# EAGLE design XForm_Clang (EAGLE 9.6.0)
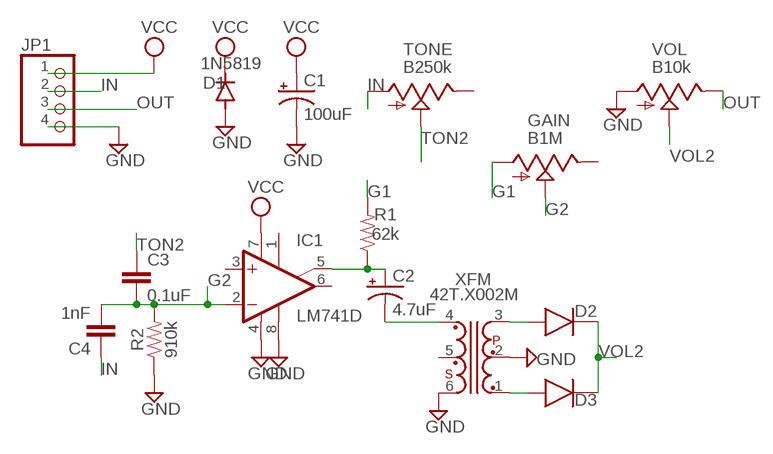
[diagram p0: schematic, sheet 1]

## Parts
C1  100uF  CAP_SMD+THRUPAN_B  [PAN_B_SMD+THRU]
C2  4.7uF  CAP_SMD+THRUPAN_B  [PAN_B_SMD+THRU]
C3  0.1uF  0.1UF-0603-25V-(+80/-20%)  [0603]
C4  1nF  1.0NF/1000PF-0603-50V-10%  [0603]
D1  1N5819  DIODE-SOD123  [SOD123]
D2  1N4148  [D35-10]
D3  1N4148  [D35-10]
GAIN  B1M  9MM_SNAP-IN_POT_  [9MM_SNAP-IN_POT]
IC1  LM741D  [SO08]
JP1  PINHD-1X4  [1X04]
R1  62k  62KOHM-0603-1/10W-5%  [0603]
R2  910k  820KOHM-0603-1/10W-1%  [0603]
TONE  B250k  9MM_SNAP-IN_POT_  [9MM_SNAP-IN_POT]
VOL  B10k  9MM_SNAP-IN_POT_  [9MM_SNAP-IN_POT]
XFM  42T.X002M  [42TM]

## Nets
G1: GAIN.1(A) R1.2
G2: C3.2 C4.2 GAIN.2(S) IC1.2(-IN) R2.2
GND: C1.- C1.--(-) D1.A IC1.4(V-) IC1.8(OPT) JP1.4 R2.1 VOL.1(A) XFM.2 XFM.6
IN: C4.1 JP1.2 TONE.1(A)
N$1: D2.A XFM.3
N$2: C2.+ C2.++(+) IC1.5(ON2) R1.1
N$3: C2.- C2.--(-) XFM.4
N$4: D3.A XFM.1
OUT: JP1.3 VOL.3(E)
TON2: C3.1 TONE.2(S)
VCC: C1.+ C1.++(+) D1.C IC1.7(V+) JP1.1
VOL2: D2.K D3.K VOL.2(S)
Unconnected: GAIN.3(E) IC1.1(ON1) IC1.3(+IN) IC1.6(OUT) TONE.3(E) XFM.5

## Library data of the parts
C1 C2 = MusicThingModular:CAP_SMD+THRU
C3 = SparkFun-Capacitors:0.1UF: 0.1µF ceramic capacitors A capacitor is a passive two-terminal electrical component used to store electrical energy temporarily in an electric field.; PROD_ID: CAP-00810
C4 = SparkFun-Capacitors:1.0NF/1000PF: 1nF/1,000pF ceramic capacitors A capacitor is a passive two-terminal electrical component used to store electrical energy temporarily in an electric field.; PROD_ID: CAP-07886
D1 = diode:DIODE-: DIODE
D2 D3 = ldr:1N4148
GAIN TONE VOL = MusicThingModular:9MM_SNAP-IN_POT: 9mm vertical snap-in pot, Alpha / Panasonic style
IC1 = linear:*741: OP AMP
JP1 = Connector:PINHD-1X4: PIN HEADER; CATEGORY: CONNECTOR; SUB-CATEGORY: PIN-HEADER
R1 = SparkFun-Resistors:62KOHM: 62kΩ resistor A resistor is a passive two-terminal electrical component that implements electrical resistance as a circuit element. Resistors act to reduce current flow, and, at the same time, act to lower voltage levels within circuits. - Wikipedia
R2 = SparkFun-Resistors:820KOHM: 820kΩ resistor A resistor is a passive two-terminal electrical component that implements electrical resistance as a circuit element. Resistors act to reduce current flow, and, at the same time, act to lower voltage levels within circuits. - Wikipedia; PROD_ID: RES-13247; VALUE: 820k
XFM = transformer:42T.X: Xicon Micro-Mini EI-12 Audio Transformers 42TL/42TC/42TM Series Source: http://www.mouser.com//catalog/specsheets/164201.pdf http://www.mouser.com/catalog/specsheets/114225.pdf http://www.mouser.com/catalog/specsheets/164267.pdf

## Board
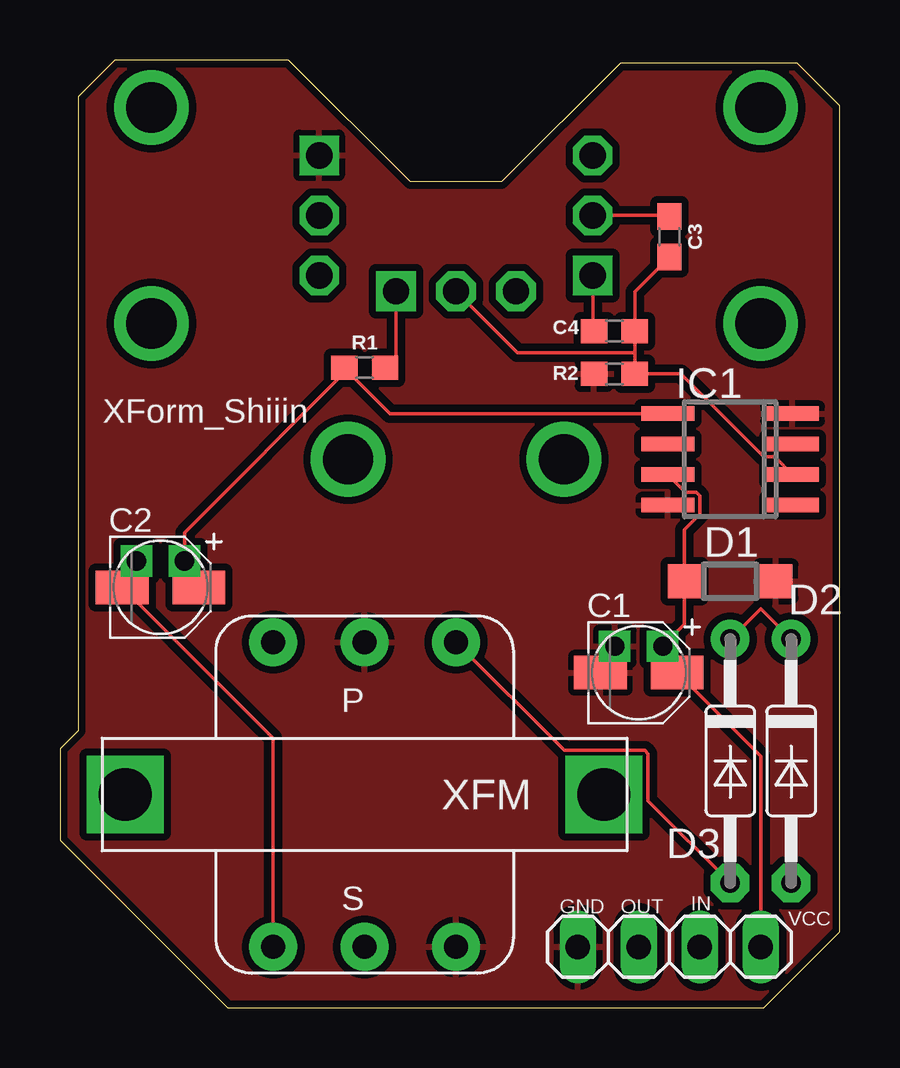
[diagram p1: board, top side]
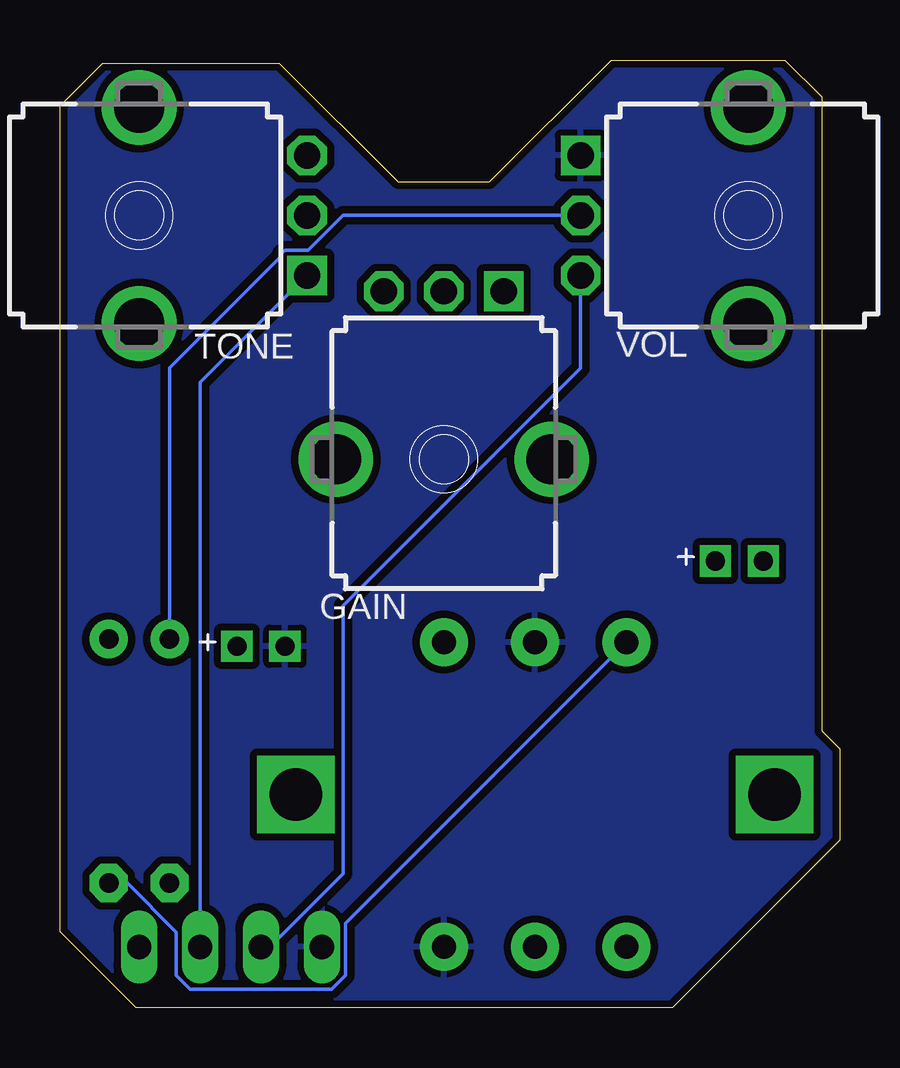
[diagram p2: board, bottom side, seen from below]

Size 32.51 x 39.5 mm. Coordinates in mm from the lower left corner, seen from the top.
Outline: 6.99,0 29.34,0 32.51,3.17 32.51,37.59 30.73,39.37 23.37,39.37 18.41,34.42 14.61,34.42 9.53,39.5 2.29,39.5 0.76,37.97 0.76,11.56 0,10.79 0,6.99 6.99,0
Copper layers (1*16): Top 0.035mm / dielectric 1.5mm / Bottom 0.035mm
Design rules "default *": minimum track width 6mil, minimum drill 0.35mm, track to track 6mil, track to pad 6mil, pad to pad 6mil, via to via 6mil, smd to smd 6mil, copper to edge 6mil, drill to drill 6mil, minimum pad ring 10mil, minimum via ring 8mil, stop-mask expansion 4mil, vias tented up to drill 0mil, thermal gap 10mil

### Footprints (pad centres in the part's own frame; a part is rotated, then mirrored left to right if it is on the bottom)
PAN_B_SMD+THRU = smd 2.2 x 1.4: + 1.6,0; - -1.6,0 | drill 0.8 pad 0.9 square: ++ 1,1.1; -- -1,1.1
0603 = smd 1.1 x 1: 1 -0.85,0; 2 0.85,0
SOD123 = smd 1.4 x 1.4: A 1.9,0; C -1.9,0
D35-10 = drill 0.813 pad 1.6 octagon: A 5.08,0 | drill 0.813 pad 1.6: K -5.08,0
9MM_SNAP-IN_POT = drill 1.1 square: 1 -2.5,-7 | drill 1.1 octagon: 2 0,-7; 3 2.5,-7 | drill 2.1 pad 2.794: CHASSIS1 -4.5,0; CHASSIS2 4.5,0
SO08 = smd 0.6 x 2.2: 1 -1.905,-2.6; 2 -0.635,-2.6; 3 0.635,-2.6; 4 1.905,-2.6; 5 1.905,2.6; 6 0.635,2.6; 7 -0.635,2.6; 8 -1.905,2.6
1X04 = drill 1.016 long: 1 -3.81,0; 2 -1.27,0; 3 1.27,0; 4 3.81,0
42TM = drill 1 pad 2: 1 -3.81,-6.35; 2 0,-6.35; 3 3.81,-6.35; 4 3.81,6.35; 5 0,6.35; 6 -3.81,6.35 | drill 2.2 square: P$1 -9.982,0; P$2 9.982,0

### Placement (x,y rotation side)
C1  24.13,13.97 0 top
C2  4.19,17.53 0 top
C3  25.4,32.13 270 top
C4  23.11,28.19 0 top
D1  27.94,17.78 0 top
D2  30.48,10.29 270 top
D3  27.94,10.29 270 top
GAIN  16.51,22.86 180 bottom
IC1  27.94,22.86 90 top
JP1  25.4,2.54 180 top
R1  12.7,26.67 0 top
R2  23.11,26.42 0 top
TONE  29.21,33.02 90 bottom
VOL  3.81,33.02 270 bottom
XFM  12.7,8.89 180 top

### Tracks (layer width: path | path; a pad name or v marks a point on that pad's centre or on a via)
G1
  Top 0.152: GAIN.1 14.01,27.13 R1.2
G2
  Top 0.152: 23.96,27.3 R2.2 25.9,26.42 29.34,22.97 29.8,22.97 IC1.2 | 23.96,27.3 C4.2 23.96,29.84 C3.2 | GAIN.2 19.07,27.3 23.96,27.3
GND
  pour Bottom (isolate 0.305): -0.38,40.01 -0.38,-0.13 0,-0.51 32.89,-0.51 33.02,-0.38 33.02,40.01
  pour Top (isolate 0.305): -0.38,40.01 -0.38,0 0.13,-0.51 32.64,-0.51 33.02,-0.13 33.02,40.01
IN
  Top 0.152: TONE.1 22.21,28.25 C4.1
  Bottom 0.152: JP1.2 26.67,26.06 TONE.1
N$1
  Bottom 0.152: XFM.3 20.6,3.53 20.6,1.37 21.18,0.79 27.08,0.79 27.66,1.37 27.66,3.15 29.71,5.21 D2.A
N$2
  Top 0.152: IC1.5 13.76,24.77 11.96,26.56 | 11.96,26.56 R1.1 | C2.++ 5.19,18.67 | 5.19,18.67 5.19,19.8 11.96,26.56 | C2.+ 5.79,18.07 5.19,18.67
N$3
  Top 0.152: XFM.4 8.89,11.23 C2.- 3.19,18.13 C2.--
N$4
  Top 0.152: XFM.1 21.02,10.73 24.39,10.73 24.52,10.59 24.52,8.63 D3.A
OUT
  Bottom 0.152: VOL.3 10.81,26.66 20.7,16.76 20.7,5.59 22,4.29 23.75,2.54 JP1.3
TON2
  Top 0.152: TONE.2 25.36,33.02 C3.1
VCC
  Top 0.152: JP1.1 29.21,10.49 C1.+ 25.13,14.57 C1.++ 26.04,15.98 26.04,17.4 D1.C 26.04,19.93 26.67,20.56 26.67,21.35 26.54,21.48 26.08,21.48 IC1.7
VOL2
  Top 0.152: D3.K 29.21,16.64 D2.K
  Bottom 0.152: VOL.2 20.72,33.02 22.17,31.57 23.13,31.57 23.26,31.44 23.26,31.35 27.94,26.67 D3.K

### Text on the board
tPlace: XForm_Shiiin | GND | OUT | IN | VCC